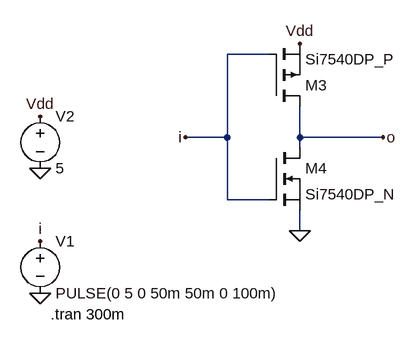
[diagram p0: schematic 1a-3-2.asc]
1a-3-2.asc, the LTspice schematic file:
Version 4
SHEET 1 880 680
WIRE 496 -176 432 -176
WIRE 432 -48 432 -176
WIRE 432 -48 368 -48
WIRE 544 -48 544 -96
WIRE 672 -48 544 -48
WIRE 544 -32 544 -48
WIRE 432 48 432 -48
WIRE 496 48 432 48
WIRE 544 96 544 64
FLAG 144 192 0
FLAG 544 96 0
FLAG 672 -48 o
FLAG 368 -48 i
FLAG 144 0 0
FLAG 144 -80 Vdd
FLAG 144 112 i
FLAG 544 -192 Vdd
SYMBOL voltage 144 96 R0
WINDOW 123 0 0 Left 0
WINDOW 39 0 0 Left 0
SYMATTR InstName V1
SYMATTR Value PULSE(0 5 0 50m 50m 0 100m)
SYMBOL voltage 144 -96 R0
WINDOW 123 0 0 Left 0
WINDOW 39 0 0 Left 0
SYMATTR InstName V2
SYMATTR Value 5
SYMBOL pmos 496 -96 M180
SYMATTR InstName M3
SYMATTR Value Si7540DP_P
SYMBOL nmos 496 -32 R0
SYMATTR InstName M4
SYMATTR Value Si7540DP_N
TEXT 160 224 Left 2 !.tran 300m

The netlist it stands for:
* 1a-3-2.asc
V1 i 0 PULSE(0 5 0 50m 50m 0 100m)
V2 Vdd 0 5
M3 o i Vdd Vdd Si7540DP_P
M4 o i 0 0 Si7540DP_N
.model NMOS NMOS
.model PMOS PMOS
.lib standard.mos
.tran 300m
.backanno
.end